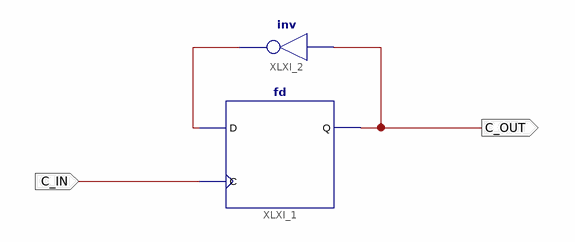
[diagram p0: schematic sheet 1]
// Xilinx ISE schematic stateToggle.sch (spartan6) as structural Verilog: 2 symbols, 2 ports
module stateToggle (
  input  C_IN,
  output C_OUT
);

  wire XLXN_3;

  fd XLXI_1 (.C(C_IN), .D(XLXN_3), .Q(C_OUT));
  not XLXI_2 (XLXN_3, C_OUT);
endmodule
